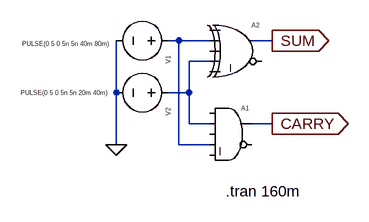
[diagram p0: schematic Half adder.asc]
Half adder.asc, the LTspice schematic file:
Version 4
SHEET 1 880 680
WIRE 96 32 80 32
WIRE 144 32 96 32
WIRE 240 32 208 32
WIRE 144 64 112 64
WIRE 0 112 0 32
WIRE 112 112 112 64
WIRE 112 112 80 112
WIRE 112 160 112 112
WIRE 144 160 112 160
WIRE 240 160 208 160
WIRE 0 192 0 112
WIRE 96 192 96 32
WIRE 144 192 96 192
FLAG 240 32 SUM
IOPIN 240 32 Out
FLAG 240 160 CARRY
IOPIN 240 160 Out
FLAG 0 192 0
SYMBOL Digital\\xor 192 -16 R0
WINDOW 0 16 24 Left 0
SYMATTR InstName A2
SYMBOL Digital\\and 176 112 R0
WINDOW 0 16 24 Left 0
SYMATTR InstName A1
SYMBOL voltage 96 112 R90
WINDOW 3 0 108 VRight 0
WINDOW 123 0 0 Left 0
WINDOW 39 0 0 Left 0
WINDOW 0 24 16 Left 0
SYMATTR Value PULSE(0 5 0 5n 5n 20m 40m)
SYMATTR InstName V2
SYMBOL voltage 96 32 R90
WINDOW 3 5 106 VRight 0
WINDOW 123 0 0 Left 0
WINDOW 39 0 0 Left 0
WINDOW 0 24 16 Left 0
SYMATTR Value PULSE(0 5 0 5n 5n 40m 80m)
SYMATTR InstName V1
TEXT 168 264 Left 2 !.tran 160m

The netlist it stands for:
* Half adder.asc
A2 0 N001 0 N002 0 0 SUM 0 XOR
A1 0 N002 0 N001 0 0 CARRY 0 AND
V2 N002 0 PULSE(0 5 0 5n 5n 20m 40m)
V1 N001 0 PULSE(0 5 0 5n 5n 40m 80m)
.tran 160m
.backanno
.end